# Altium project 雾霾检测器.PrjPCB
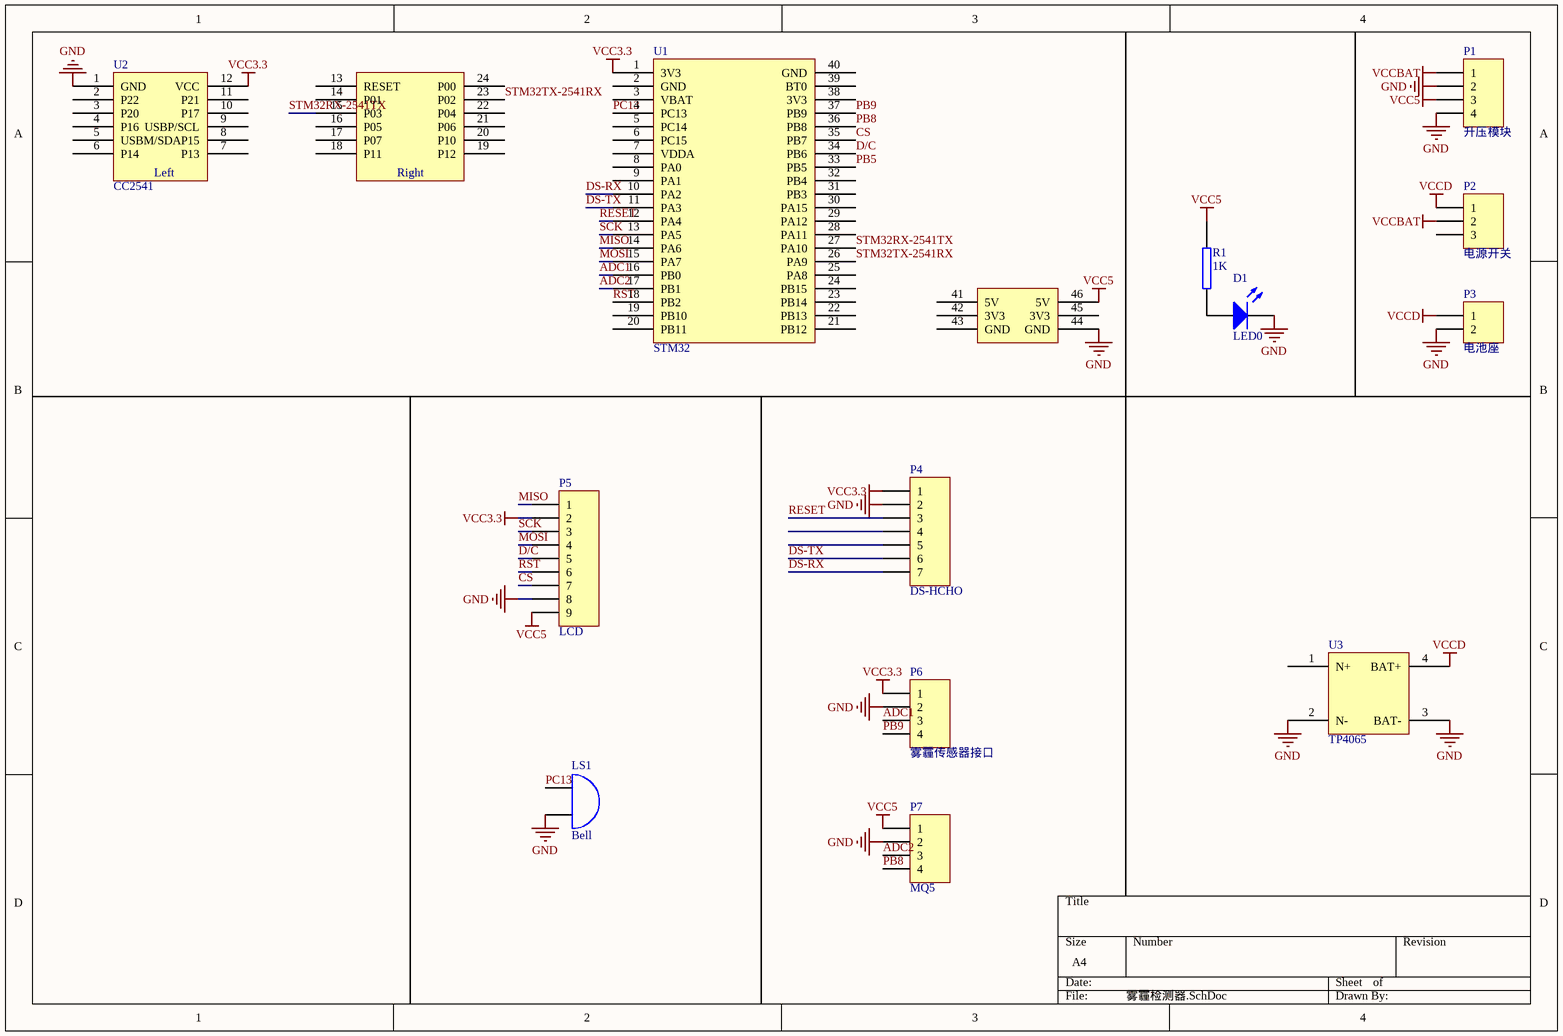
[diagram p0: 雾霾检测器.SchDoc]
1 sheet, 13 parts. Net scope: global (net labels, ports and power ports of the same name join across sheets).
Board file: 雾霾检测器PCB.PcbDoc

## Sheet 雾霾检测器.SchDoc
size A4

### Parts
D1  LED0  [0805-led]
LS1  Bell  [BUZZER-12MM]
P1  升压模块  [DC-DC升压模块]
P2  电源开关  [拨动开关（2mm）]
P3  电池座  [7号电池盒-4.5CM]
P4  DS-HCHO  [HDR1X7]
P5  LCD  [HDR1X9]
P6  雾霾传感器接口  [HDR1X4]
P7  MQ5  [HDR1X4]
R1  1K  [0805-SMALL]
U1  STM32  [STM32_Smart]
U2  CC2541  [Smart_RF_2541]
U3  TP4065  [TP4065_模块]

### Nets
GND: D1.2(K) LS1.2(B) P1.2 P1.4 P3.2 P4.2 P5.8 P6.2 P7.2 U1.44(GND) U2.1(GND) U3.2(N-) U3.3(BAT-)
VCC3.3: P4.1 P5.2 P6.1 U1.1(3V3) U2.12(VCC)
VCC5: P1.3 P5.9 P7.1 R1.2 U1.46(5V)
VCCBAT: P1.1 P2.2
VCCD: P2.1 P3.1 U3.4(BAT+)
ADC1: P6.3 U1.16(PB0)
ADC2: P7.3 U1.17(PB1)
CS: P5.7 U1.35(PB7)
D/C: P5.5 U1.34(PB6)
DS-RX: P4.7 U1.10(PA2)
DS-TX: P4.6 U1.11(PA3)
MISO: P5.1 U1.14(PA6)
MOSI: P5.4 U1.15(PA7)
PB5: U1.33(PB5)
PB8: P7.4 U1.36(PB8)
PB9: P6.4 U1.37(PB9)
PC13: LS1.1(A) U1.4(PC13)
RESET: P4.3 U1.12(PA4)
RST: P5.6 U1.18(PB2)
SCK: P5.3 U1.13(PA5)
STM32RX-2541TX: U1.27(PA10) U2.15(P03)
STM32TX-2541RX: U1.26(PA9) U2.23(P02)
NetD1_1: D1.1(A) R1.1

Not connected (* = marked no-connect by the designer): P2 3; P4 4 5; U1 2(GND) 3(VBAT) 5(PC14) 6(PC15) 7(VDDA) 8(PA0) 9(PA1) 19(PB10) 20(PB11) 21(PB12) 22(PB13) 23(PB14) 24(PB15) 25(PA8) 28(PA11) 29(PA12) 30(PA15) 31(PB3) 32(PB4) 38(3V3) 39(BT0) 40(GND) 41(5V) 42(3V3) 43(GND) 45(3V3); U2 2(P22) 3(P20) 4(P16) 5(USBM/SDA) 6(P14) 7(P13) 8(P15) 9(USBP/SCL) 10(P17) 11(P21) 13(RESET) 14(P01) 16(P05) 17(P07) 18(P11) 19(P12) 20(P10) 21(P06) 22(P04) 24(P00); U3 1(N+)

### Notes on the sheet
- (in symbol Smart_RF_2541) Left; Right

### Library data of the parts
D1 = LED0: Typical INFRARED GaAs LED; Published: 8-Jun-2000; LatestRevisionDate: 08-Jul-2005; LatestRevisionNote: Mech Layer 1 removed.; PackageReference: LED-0; Publisher: Altium Limited; PackageDescription: LED; 2 Leads
LS1 = Bell: Electrical Bell; Published: 24-Mar-1999; LatestRevisionDate: 17-Jul-2002; LatestRevisionNote: Re-released for DXP Platform.; PackageReference: PIN2; Publisher: Altium Limited
P1 P6 P7 = Header 4: Header, 4-Pin; LatestRevisionDate: 17-Jul-2002; LatestRevisionNote: Re-released for DXP Platform.; Publisher: Altium Limited
P2 = Header 3: Header, 3-Pin; LatestRevisionDate: 17-Jul-2002; LatestRevisionNote: Re-released for DXP Platform.; Publisher: Altium Limited
P3 = Header 2: Header, 2-Pin; LatestRevisionDate: 17-Jul-2002; LatestRevisionNote: Re-released for DXP Platform.; Publisher: Altium Limited
P4 = Header 7: Header, 7-Pin; LatestRevisionDate: 17-Jul-2002; LatestRevisionNote: Re-released for DXP Platform.; Publisher: Altium Limited
P5 = Header 9: Header, 9-Pin; LatestRevisionDate: 17-Jul-2002; LatestRevisionNote: Re-released for DXP Platform.; Publisher: Altium Limited
R1 = RES2
U1 = STM32_Smart
U2 = Smart_RF_2541
U3 = TP4056_ 模块